# EAGLE design LongWaveModule (EAGLE 9.6.2)
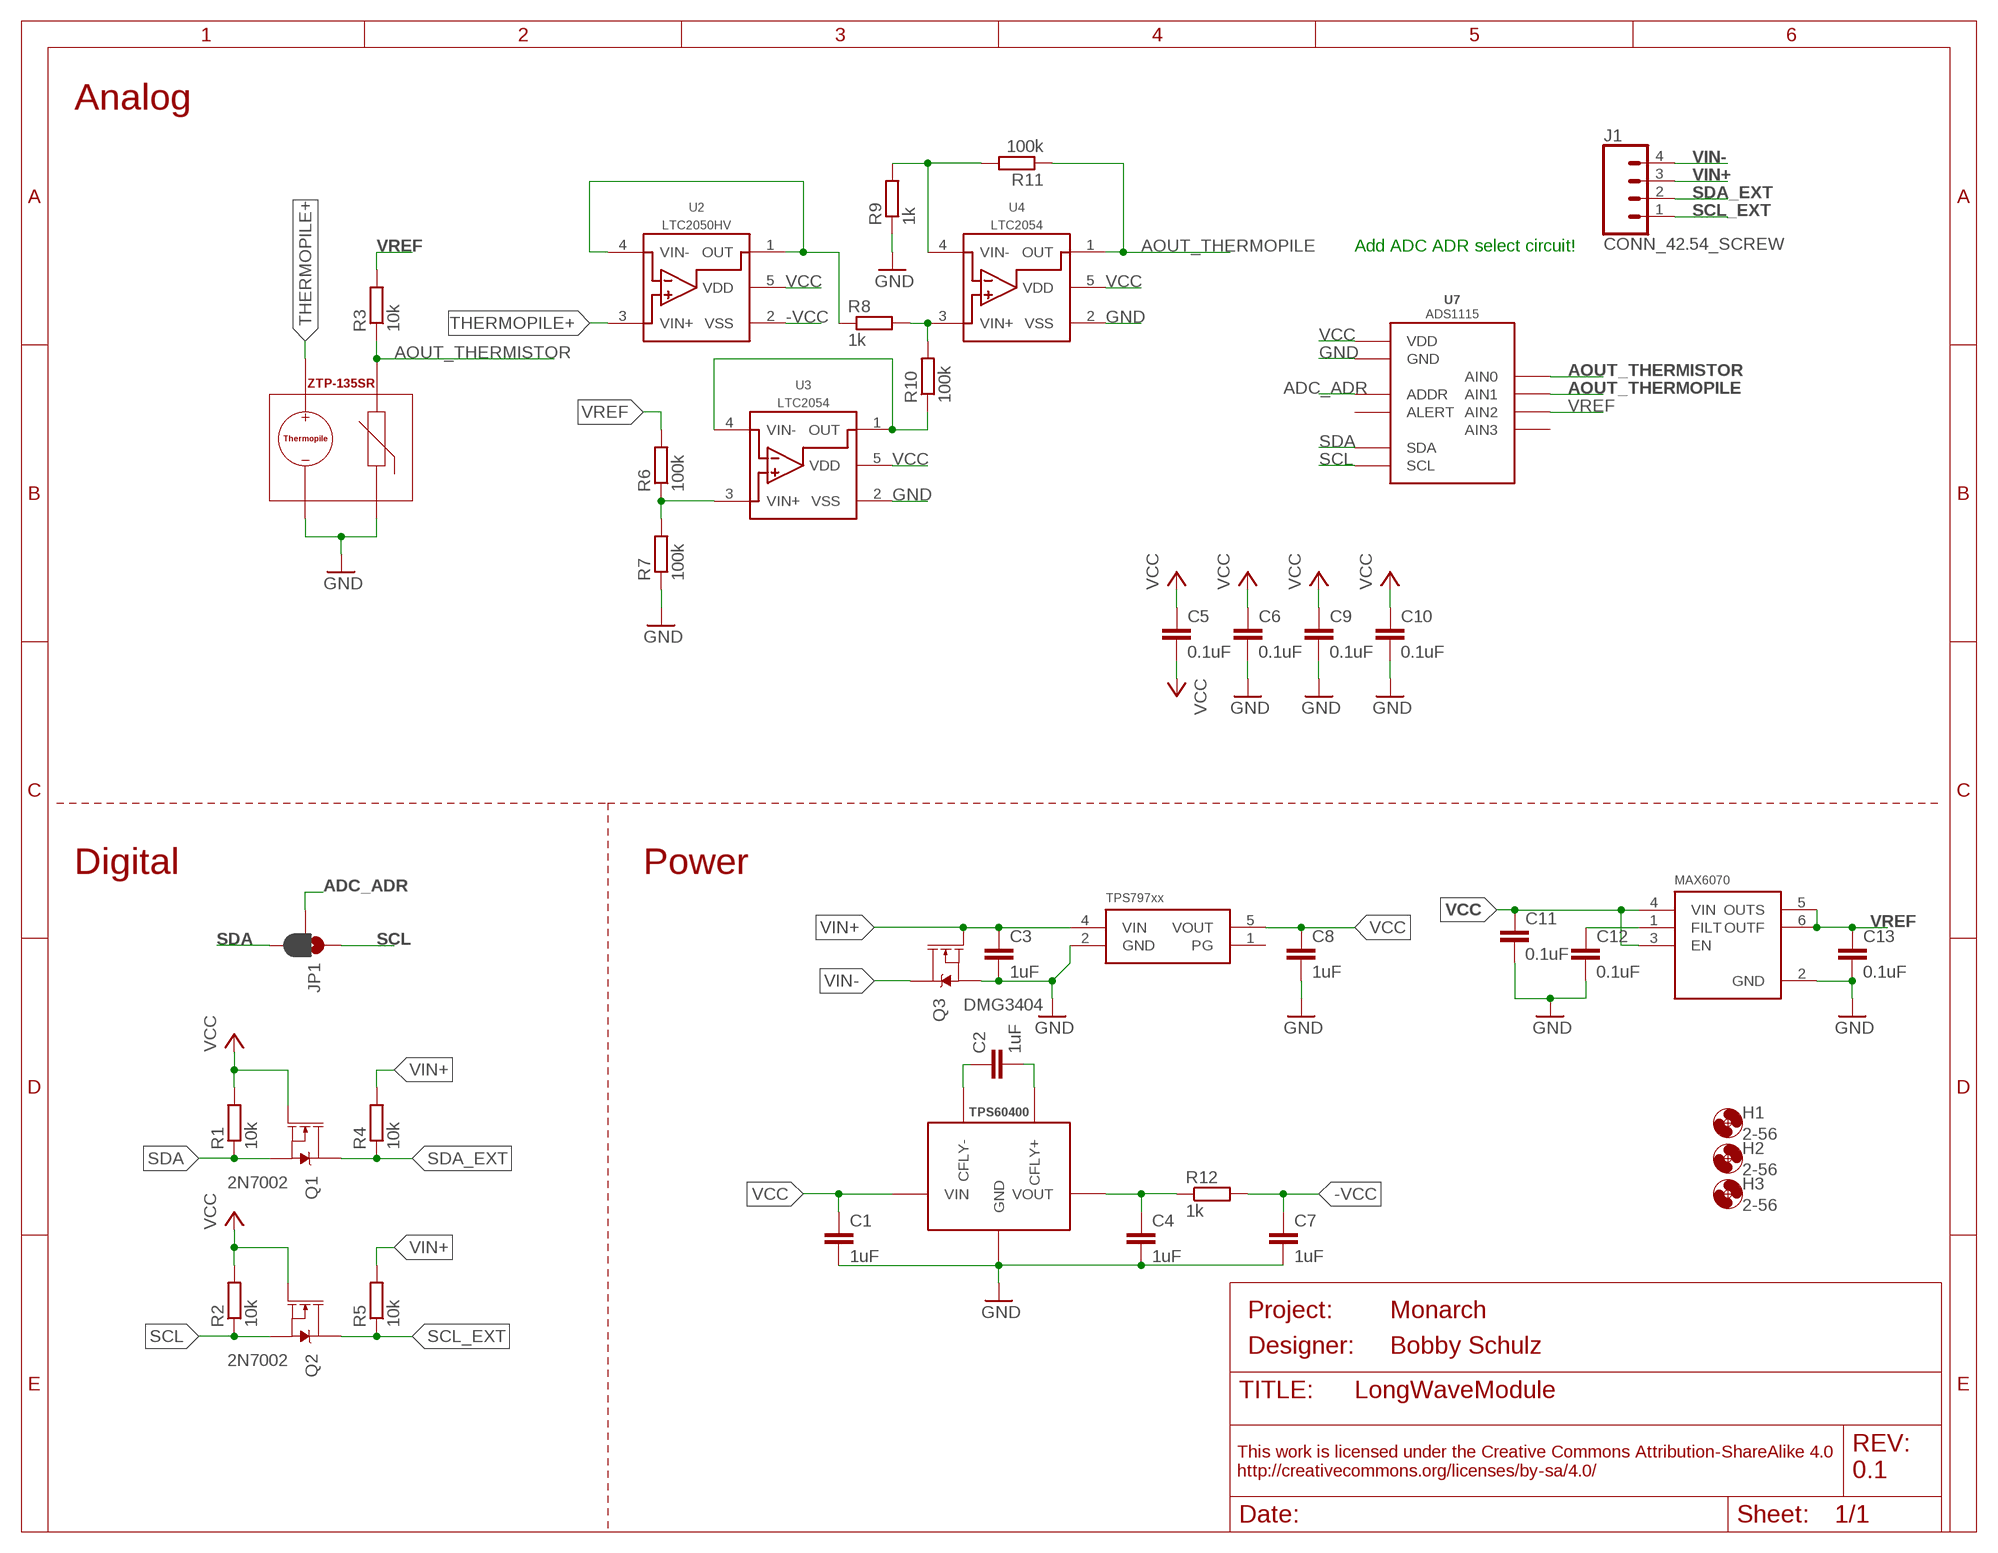
[diagram p0: schematic, sheet 1]
FRAME1 (FRAME_A_L): DESIGNER: Bobby Schulz; PROJECT: Monarch; REV: 0.1

## Parts
C1  1uF  C-EU1UFC0603  [C0603]
C2  1uF  C-EU1UFC0603  [C0603]
C3  1uF  C-EU1UFC0603  [C0603]
C4  1uF  C-EU1UFC0603  [C0603]
C5  0.1uF  C-EU0.1UFC0603  [C0603]
C6  0.1uF  C-EU0.1UFC0603  [C0603]
C7  1uF  C-EU1UFC0603  [C0603]
C8  1uF  C-EU1UFC0603  [C0603]
C9  0.1uF  C-EU0.1UFC0603  [C0603]
C10  0.1uF  C-EU0.1UFC0603  [C0603]
C11  0.1uF  C-EU0.1UFC0603  [C0603]
C12  0.1uF  C-EU0.1UFC0603  [C0603]
C13  0.1uF  C-EU0.1UFC0603  [C0603]
H1  2-56  MOUNTING_HOLE2_NP  [2_56]
H2  2-56  MOUNTING_HOLE2_NP  [2_56]
H3  2-56  MOUNTING_HOLE2_NP  [2_56]
J1  CONN_42.54_SCREW  [1X04_SCREW]
JP1  JUMPER-SMT_3_1-NC_PASTE_SILK  [SMT-JUMPER_3_1-NC_PASTE_SILK]
Q1  2N7002  MOSFET-NCH-2N7002PW  [SOT323]
Q2  2N7002  MOSFET-NCH-2N7002PW  [SOT323]
Q3  DMG3404  MOSFET-NCH-DMG3404L  [SOT23-3]
R1  10k  R-EU_10KR0603  [R0603]
R2  10k  R-EU_10KR0603  [R0603]
R3  10k  R-EU_P10KR0603  [R0603]
R4  10k  R-EU_10KR0603  [R0603]
R5  10k  R-EU_10KR0603  [R0603]
R6  100k  R-EU_P100KR0603  [R0603]
R7  100k  R-EU_P100KR0603  [R0603]
R8  1k  R-EU_P1KR0603  [R0603]
R9  1k  R-EU_P1KR0603  [R0603]
R10  100k  R-EU_P100KR0603  [R0603]
R11  100k  R-EU_P100KR0603  [R0603]
R12  1k  R-EU_1KR0603  [R0603]
U1  STP-135SR  [TO-46]
U2  LTC2050HV  [SOT23-5]
U3  LTC2054  [SOT23-5]
U4  LTC2054  [SOT23-5]
U5  TPS60403  [SOT23-5]
U6  TPS79733  [DCK_R-PDSO-G5]
U7  ADS1115  [VSSOP_10]
U8  MAX6070AAUT18  [SOT23-6L]

## Nets
-VCC: C5.2 C7.1 R12.2 U2.2(VSS) ; supply symbol labelled VCC
ADC_ADR: JP1.2 U7.1(ADDR)
AOUT_THERMISTOR: R3.1 U1.THERMISTOR+ U7.4(AIN0)
AOUT_THERMOPILE: R11.1 U4.1(OUT) U7.5(AIN1)
GND: C1.2 C3.2 C4.2 C6.2 C7.2 C8.2 C9.2 C10.2 C11.2 C12.2 C13.2 Q3.2(S) R7.1 R9.1 U1.THERMISTOR_GND(THERMISTOR-) U1.THERMOPILE_GND(THEMROPILE-) U3.2(VSS) U4.2(VSS) U5.4(GND) U6.2(GND) U7.3(GND) U8.2(GND)
N$1: R8.1 U2.1(OUT) U2.4(VIN-)
N$2: R8.2 R10.2 U4.3(VIN+)
N$3: R9.2 R11.2 U4.4(VIN-)
N$5: R10.1 U3.1(OUT) U3.4(VIN-)
N$6: R6.1 R7.2 U3.3(VIN+)
N$8: C12.1 U8.1(FILT)
N$11: C2.1 U5.3(CFLY-)
N$12: C2.2 U5.5(CFLY+)
N$21: C4.1 R12.1 U5.1(VOUT)
SCL: JP1.1 Q2.2(S) R2.1 U7.10(SCL)
SCL_EXT: J1.1 Q2.3(D) R5.1
SDA: JP1.3 Q1.2(S) R1.1 U7.9(SDA)
SDA_EXT: J1.2 Q1.3(D) R4.1
THERMOPILE+: U1.THERMOPILE+ U2.3(VIN+)
VCC: C1.1 C5.1 C6.1 C8.1 C9.1 C10.1 C11.1 Q1.1(G) Q2.1(G) R1.2 R2.2 U2.5(VDD) U3.5(VDD) U4.5(VDD) U5.2(VIN) U6.5(VOUT) U7.8(VDD) U8.3(EN) U8.4(VIN)
VIN+: C3.1 J1.3 Q3.1(G) R4.2 R5.2 U6.4(VIN)
VIN-: J1.4 Q3.3(D)
VREF: C13.1 R3.2 R6.2 U7.6(AIN2) U8.5(OUTS) U8.6(OUTF)
Unconnected: U6.1(PG) U7.2(ALERT) U7.7(AIN3)

## Notes on the sheet
- Analog
- Add ADC ADR select circuit!
- Digital | Power

## Library data of the parts
C1-C4 C7 C8 = bschulz_passives:C-EU: CAPACITOR, European symbol; DIGIKEY: 1276-6524-1-ND; MF: Samsung; MPN: 1276-6524-1-ND
C5 C6 C9-C13 = bschulz_passives:C-EU: CAPACITOR, European symbol; DIGIKEY: 490-6051-1-ND; MF: Murata; MPN: GCM188R71E104KA57D
H1-H3 = bschulz:MOUNTING_HOLE: Genaric Mechanical Mounting Hole Hole diameter based on max body diameter + 15% Keepout ring is for diameter of socket cap screw (minimum required clearance) TPlace ring is for diameter of pan head screw (recomended clearance) Specifications: Socket Cap <http://fastener-express.com/fastener-technical/SocketscapSS-Alloy.pdf> Button Head Socket Cap <http://fastener-express.com/fastener-technical/Button-Socket-alloy.pdf> Pan Head <http://fastener-express.com/fastener-technical/pan-machine-Screws.pdf>
J1 = bschulz:CONN_4: Genaric 4 pin connector; DIGIKEY: ED10563-ND; MF: On Shore; MPN: OSTVN04A150
JP1 = SparkFun-Jumpers:JUMPER-SMT_3_1-NC_PASTE: Normally closed solder jumper (1 of 2 connections) This jumper has an aperture in the stencil to allow solder paste to bridge one of the two connections. One connection is normally closed (NC), while the other is normally open (NO). Wick off the solder to open the connection. Reapply solder to reclose the connection. Apply solder to the other side instead to change the current path.
Q1 Q2 = bschulz:MOSFET-NCH: N-channel MOSFETs Voltage controlled devices that allow control of high current outputs. SparkFun Products: SparkFun OpenScale <https://www.sparkfun.com/products/13261> SparkFun Digital Sandbox <https://www.sparkfun.com/products/12651> SparkFun Monster Moto Shield <https://www.sparkfun.com/products/10182> SparkFun MOSFET Power Controller <https://www.sparkfun.com/products/11214>; DIGIKEY: 2N7002W-FDICT-ND; MF: Diodes Incorporated; MPN: 2N7002W-7-F; PROD_ID: TRANS-11151
Q3 = bschulz:MOSFET-NCH: N-channel MOSFETs Voltage controlled devices that allow control of high current outputs. SparkFun Products: SparkFun OpenScale <https://www.sparkfun.com/products/13261> SparkFun Digital Sandbox <https://www.sparkfun.com/products/12651> SparkFun Monster Moto Shield <https://www.sparkfun.com/products/10182> SparkFun MOSFET Power Controller <https://www.sparkfun.com/products/11214>; DIGIKEY: DMG3404L-7DICT-ND; MF: Diodes Incorporated; MPN: DMG3404L-7
R1 R2 R4 R5 = bschulz_passives:R-EU_: RESISTOR, European symbol; DIGIKEY: P10.0KHCT-ND; MF: Panasonic; MPN: ERJ-3EKF1002V; VALUE_PART: 10k
R3 = bschulz_passives:R-EU_: RESISTOR, European symbol; DIGIKEY: P10KDBCT-ND; MF: Panasonic; MPN: ERA-3AEB103V; VALUE_PART: 10k
R6 R7 R10 R11 = bschulz_passives:R-EU_: RESISTOR, European symbol; DIGIKEY: P100KDBCT-ND; MF: Panasonic; MPN: ERA-3AEB104V; VALUE_PART: 100k
R8 R9 = bschulz_passives:R-EU_: RESISTOR, European symbol; DIGIKEY: P1.0KDBCT-ND; MF: Panasonic; MPN: ERA-3AEB102V; VALUE_PART: 1k
R12 = bschulz_passives:R-EU_: RESISTOR, European symbol; DIGIKEY: 311-1KLDCT-ND; MF: Yageo; MPN: AC0603FR-071KL; VALUE_PART: 1k
U1 = bschulz:STP-135SR: ZTP-135SR - Thermopile Temp Sensor with integrated thermistor Characteristics: Output Voltage: -6mV ~ +12mV Operating Temperature: -20°C to 120°C Thermistor R0 = 100k Ω Thermistor β = 3960 Digikey: 235-1330-ND <https://www.digikey.com/scripts/DkSearch/dksus.dll?Detail&itemSeq=258317337&uq=636602773549185500>; DIGIKEY: 235-1330-ND; MF: Amphenol; MPN: ZTP-135SR
U2 = bschulz:LTC2050: LTC2050 -Single Micropower Zero Drift Op-Amp Characteristics: Vs: 2.7 ~ 6V (1.35 ~ +/- 5.5V for LTC2054HV) Iq: 1mA GBP: 3MHz PSSR: 130dB CMMR: 130dB Operating Temperature: -40°C to 85°C Digikey: LTC2050IS6#TRMPBFCT-ND <https://www.digikey.com/product-detail/en/linear-technology-analog-devices/LTC2050IS6-TRMPBF/LTC2050IS6-TRMPBFCT-ND/4729352> LTC2050HVIS5#TRPBFCT-ND (High Voltage Variant) <https://www.digikey.com/product-detail/en/linear-technology-analog-devices/LTC2050HVIS5-TRPBF/LTC2050HVIS5-TRPBFCT-ND/8603412>; DIGIKEY: LTC2050HVIS5#TRPBFCT-ND; DISP: LTC2050HV; MF: LT; MPN: LTC2050HVIS5#TRPBF
U3 U4 = bschulz:LTC2054: LTC2054 -Single Micropower Zero Drift Op-Amp Characteristics: Vs: 2.7 ~ 6V (2.7 ~ +/- 5.5V for LTC2054HV) Iq: 175uA GBP: 500kHz PSSR: 130dB CMMR: 130dB Operating Temperature: -40°C to 85°C Digikey: LTC2054CS5#TRPBFCT-ND <https://www.digikey.com/scripts/DkSearch/dksus.dll?Detail&itemSeq=258611552&uq=636603257096973101> LTC2054HVIS5#TRMPBFCT-ND (High Voltage Variant) <https://www.digikey.com/product-detail/en/linear-technology-analog-devices/LTC2054HVIS5-TRMPBF/LTC2054HVIS5-TRMPBFCT-ND/3830416>; DIGIKEY: LTC2054HS5#TRMPBFCT-ND; DISP: LTC2054; MF: LT; MPN: LTC2054HS5#TRMPBF
U5 = bschulz:TPS6040*: TPS6040x - Unregulated Charge Pump Voltage Inverter Characteristics: Vin: 1.8V ~ 5.25V Vout: -Vin Output Current: 60 mA Quiescent Current: 65 ~ 425 uA (depend on model) Operating Temperature: -40°C to125°C Digikey: 296-12013-1-ND, TPS60400 (fsw = 50 ~ 250kHz) <https://www.digikey.com/product-detail/en/texas-instruments/TPS60400DBVT/296-12013-1-ND/429166> 296-37679-1-ND, TPS60401 (fsw = 20kHz) <https://www.digikey.com/product-detail/en/texas-instruments/TPS60401DBVR/296-37679-1-ND/4833911> 296-31988-1-ND, TPS60402 (fsw = 50kHz) <https://www.digikey.com/product-detail/en/texas-instruments/TPS60402DBVR/296-31988-1-ND/3505322> 296-27005-1-ND, TPS60403 (fsw = 250kHz) <https://www.digikey.com/product-detail/en/texas-instruments/TPS60403DBVR/296-27005-1-ND/2255295>; DIGIKEY: 296-27005-1-ND; MF: TI; MPN: TPS60403DBVR
U6 = bschulz:TPS797*: TPS797xx, Ultra low power linear voltage regulator, fixed voltages of 1.8v, 3v, 3.3v Input voltage rage of 1.8-5.5v; DIGIKEY: 296-11990-1-ND; MF: TI; MPN: TPS79733DCKR
U7 = bschulz:ADS111*: ADS1115 - Sigma Delta ADC Characteristics: VCC: 2~5.5V Resolution: 16 bits (12 bits for ADS1015) Number of Inputs: 4 (2 Differenital) Sample Rate: 860 Samples Per Second (3300 for ADS1015) Operating Temperature: -40°C to 125°C Digikey: 296-38849-1-ND (ADS1115) <https://www.digikey.com/scripts/DkSearch/dksus.dll?Detail&itemSeq=258904888&uq=636603311183646020> 296-41185-1-ND (ADS1015) <https://www.digikey.com/product-detail/en/texas-instruments/ADS1015IDGSR/296-41185-1-ND/5222640>; DIGIKEY: 296-38849-1-ND; MF: TI; MPN: ADS1115IDGSR
U8 = bschulz:MAX6070AAUT*: MAX6070 Low Noise high precision voltage referance; DIGIKEY: MAX6070BAUT18+TCT-ND; MF: Maxim; MPN: MAX6070BAUT18+T

## Board
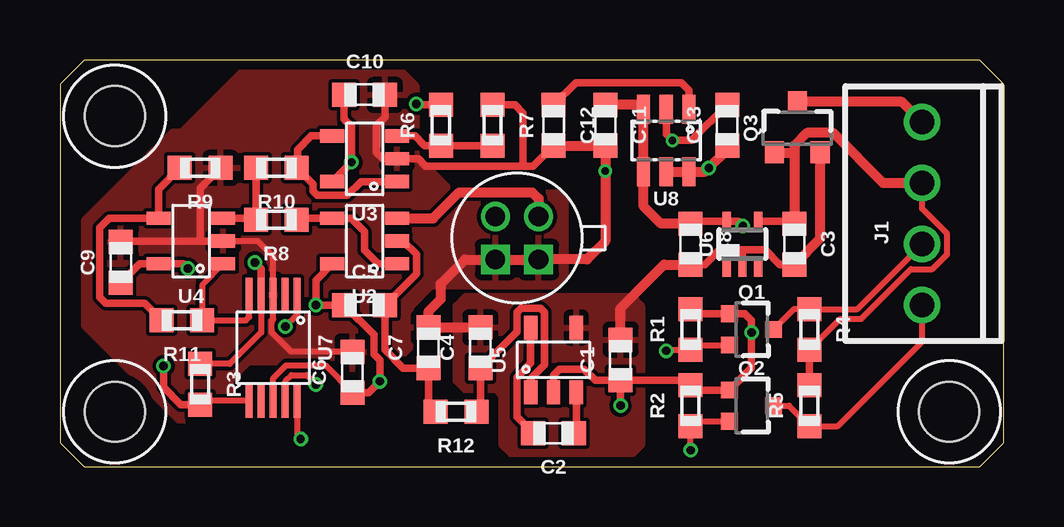
[diagram p1: board, top side]
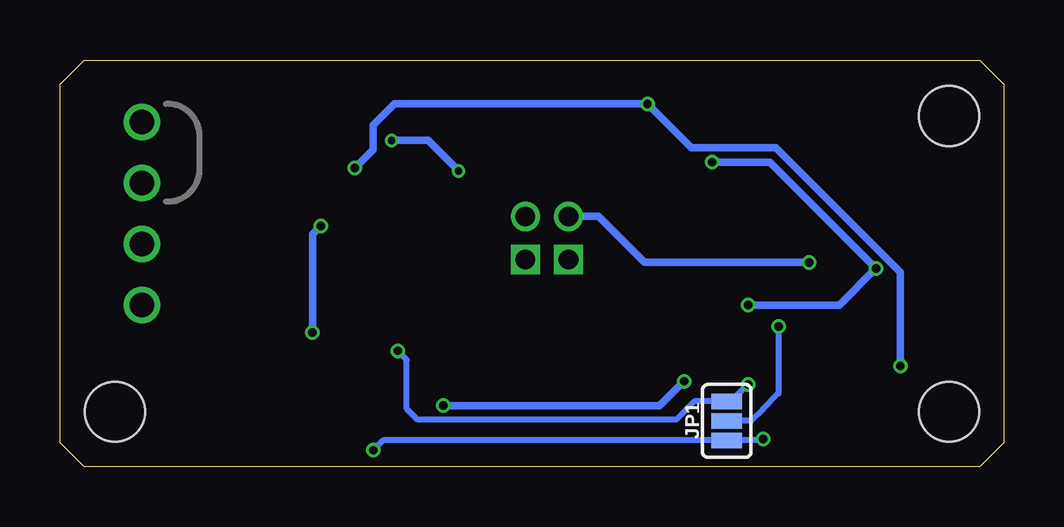
[diagram p2: board, bottom side, seen from below]

Size 39.35 x 16.94 mm. Coordinates in mm from the lower left corner, seen from the top.
Outline: 1,0 38.35,0 39.35,1 39.35,15.94 38.35,16.94 1,16.94 0,15.94 0,1 1,0
Copper layers (1*16): Top 0.035559375mm / dielectric 1.6mm / Bottom 0.035559375mm
Design rules "oshpark-2layer": minimum track width 6mil, minimum drill 10mil, track to track 6mil, track to pad 6mil, pad to pad 6mil, via to via 6mil, smd to smd 6mil, copper to edge 15mil, drill to drill 6mil, minimum pad ring 5mil, minimum via ring 5mil, stop-mask expansion 2.5mil, vias tented up to drill 0mil, thermal gap 10mil

### Footprints (pad centres in the part's own frame; a part is rotated, then mirrored left to right if it is on the bottom)
C0603 = smd 1 x 1: 1 -0.85,0; 2 0.85,0
2_56 = hole 2.5: 0,0
1X04_SCREW = drill 1.016: 1 -3.81,0; 2 -1.27,0; 3 1.27,0; 4 3.81,0
SMT-JUMPER_3_1-NC_PASTE_SILK = smd 0.635 x 1.27: 1 -0.813,0; 2 0,0; 3 0.813,0
SOT323 = smd 0.7 x 0.7: 1 -0.65,-0.925; 2 0.65,-0.925; 3 0,0.925
SOT23-3 = smd 0.8 x 0.9: 1 -0.95,-1; 2 0.95,-1; 3 0,1.1
R0603 = smd 1 x 1: 1 -0.85,0; 2 0.85,0
TO-46 = drill 0.813: THERMISTOR+ -0.898,0.898; THERMOPILE+ 0.898,0.898 | drill 0.813 square: THERMISTOR_GND 0.898,-0.898; THERMOPILE_GND -0.898,-0.898
SOT23-5 = smd 0.55 x 1: 1 -0.95,-1.35; 2 0,-1.35; 3 0.95,-1.35; 4 0.95,1.35; 5 -0.95,1.35
DCK_R-PDSO-G5 = smd 0.35 x 0.8: 1 -0.65,-0.95; 2 0,-0.95; 3 0.65,-0.95; 4 0.65,0.95; 5 -0.65,0.95
VSSOP_10 = smd 0.3 x 1.45: 1 -1,-2.2; 2 -0.5,-2.2; 3 0,-2.2; 4 0.5,-2.2; 5 1,-2.2; 6 1,2.2; 7 0.5,2.2; 8 0,2.2; 9 -0.5,2.2; 10 -1,2.2
SOT23-6L = smd 0.55 x 1.2: 1 -0.95,-1.3; 2 0,-1.3; 3 0.95,-1.3; 4 0.95,1.3; 5 0,1.3; 6 -0.95,1.3

### Placement (x,y rotation side)
C1  23.37,4.45 90 top
C2  20.57,1.4 180 top
C3  30.61,9.27 270 top
C4  17.53,4.95 90 top
C5  12.7,6.73 0 top
C6  12.19,3.94 90 top
C7  15.37,4.95 90 top
C8  26.29,9.27 270 top
C9  2.54,8.51 90 top
C10  12.7,15.49 0 top
C11  22.73,14.22 270 top
C12  20.57,14.22 270 top
C13  27.81,14.22 90 top
H1  2.29,14.61 0 top
H2  2.29,2.29 0 top
H3  37.06,2.29 0 top
J1  35.94,10.54 90 top
JP1  11.56,1.91 90 bottom
Q1  28.83,5.71 270 top
Q2  28.83,2.54 270 top
Q3  30.73,14.1 0 top
R1  26.29,5.71 90 top
R2  26.29,2.54 90 top
R3  5.84,3.43 270 top
R4  31.24,5.71 270 top
R5  31.24,2.54 90 top
R6  15.88,14.22 90 top
R7  18.03,14.22 270 top
R8  9.02,10.29 180 top
R9  5.84,12.45 180 top
R10  9.02,12.45 180 top
R11  5.08,6.1 180 top
R12  16.51,2.29 180 top
U1  19.05,9.53 0 top
U2  12.7,9.4 90 top
U3  12.7,12.83 90 top
U4  5.46,9.4 90 top
U5  20.57,4.45 0 top
U6  28.45,9.27 0 top
U7  8.89,4.95 180 top
U8  25.27,13.59 180 top

### Tracks (layer width: path | path; a pad name or v marks a point on that pad's centre or on a via)
-VCC
  Top 0.305: R12.2 15.37,2.58 C7.1 14.31,4.1 13.55,4.87 C5.2 14.86,8.04 14.86,8.85 14.31,9.4 U2.2
ADC_ADR  (via drill 0.35)
  Top 0.254: U7.1 9.89,6.33 v9.4,5.84
  Bottom 0.254: v9.4,5.84 9.4,3.05 10.03,2.41 10.54,1.91 JP1.2
AOUT_THERMISTOR  (via drill 0.35)
  Top 0.254: U7.4 8.39,5.6 7.07,4.28 R3.1
  Top 0.305: U7.4 8.39,8.25 v8.13,8.51
  Bottom 0.305: U1.THERMISTOR+ 16.9,10.42 14.99,8.51 v8.13,8.51
AOUT_THERMOPILE
  Top 0.254: U4.1 5.93,7.57 R11.1 7.75,6.1 7.89,6.24 U7.5
GND  (via drill 0.3)
  Top 0.254: U4.2 8.26,9.4 8.89,8.76 U7.3 8.89,6.16 8.82,6.08 8.82,5.6 9.63,4.79 C6.2 | C10.2 13.29,15.49
  Top 0.305: C8.2 26.89,8.42 27.5,9.03 28.45,9.03 | C3.2 30,8.42 29.4,9.03 28.45,9.03 | U6.2 28.45,9.03 | C10.2 13.55,14.57 13.21,14.22 13.21,13.08 13.46,12.83 U3.2 14.94,12.83 15.25,12.52 19.3,12.52 | 19.3,12.52 19.72,12.52 C12.2 | R7.1 18.96,15.07 19.3,14.73 19.3,12.52 | R9.1 5.84,11.6 5.84,9.4 | U4.2 5.84,9.4 | 5.84,9.4 2.58,9.4 C9.2 | C13.2 26.33,13.59 v25.53,13.59 25.27,13.84 U8.2
  Top 0.406: C12.2 C11.2 v22.73,12.32 22.73,9.4 21.97,8.64 U1.THERMISTOR_GND U1.THERMOPILE_GND 16.88,8.63 15.88,7.62 15.88,6.99 15.37,6.48 C7.2 C4.2 | Q3.2 31.68,9.5 C3.2 | C1.2 23.37,6.6 25.18,8.42 C8.2 | 25.27,14.73 U8.2
  Bottom 0.305: v25.53,13.59 24,13.59 v22.73,12.32
  pour Top: 16.51,6.73 16.89,7.11 23.88,7.11 24.26,6.73 24.26,0.89 23.88,0.51 18.8,0.51 18.41,0.89 18.41,2.92 18.16,3.17 16.89,3.17 16.51,3.56
  pour Top: 5.08,13.97 7.87,16.76 13.97,16.76 14.86,15.88 14.86,12.95 16.38,11.43 20.7,11.43 21.08,11.05 21.08,7.87 20.7,7.49 15.49,7.49 14.61,6.6 14.61,4.95 13.72,4.06 11.18,4.06 10.92,4.32 7.87,4.32 7.11,3.56 7.11,2.29 6.73,1.91 4.95,1.91 1.02,5.84 1.02,10.29 4.7,13.97
N$1
  Top 0.305: U2.1 13.27,8.45 12.7,9.02 12.7,9.78 12.13,10.35 U2.4 9.93,10.35 R8.1
N$2
  Top 0.305: U4.3 8.11,10.35 R8.2 R10.2
N$3
  Top 0.305: R9.2 4.11,11.56 U4.4 2.05,10.35 1.65,9.95 1.65,7.07 1.91,6.8 3.52,6.8 R11.2
N$5
  Top 0.305: U3.1 12.56,11.88 11.98,11.3 10.72,11.3 10.54,11.48 10.54,11.77 R10.1 9.91,12.48 9.91,13.21 10.47,13.78 U3.4
N$6
  Top 0.305: U3.3 14.8,13.78 15.2,13.37 R6.1 R7.2
N$8
  Top 0.305: C12.1 21.5,16 25.91,16 26.22,15.69 U8.1
N$11
  Top 0.305: C2.1 21.52,1.5 U5.3
N$12
  Top 0.305: U5.5 19.62,4.3 19.04,3.72 19.04,2.08 C2.2
N$21
  Top 0.305: U5.1 19.62,3.65 20.2,4.23 20.2,6.42 20.02,6.6 19.22,6.6 19.04,6.42 19.04,5.62 C4.1 17.53,2.45 R12.1
SCL  (via drill 0.35)
  Top 0.254: Q2.2 26.49,1.89 R2.1 v26.29,0.68 | U7.10 9.89,1.29 v10.03,1.14
  Bottom 0.254: v10.03,1.14 10.08,1.09 JP1.1 25.88,1.09 v26.29,0.68
SCL_EXT
  Top 0.254: Q2.3 30.39,2.54 R5.1 32.42,1.69 35.94,5.21 J1.1
SDA  (via drill 0.35)
  Top 0.254: Q1.2 26.49,5.07 R1.1 25.31,4.87 v25.27,4.83 | U7.9 9.39,3.55 9.65,3.81 10.29,3.81 v10.67,3.43
  Bottom 0.254: v10.67,3.43 11.38,2.72 JP1.3 12.9,2.72 13.66,1.96 24.44,1.96 24.89,2.41 24.89,4.45 v25.27,4.83
SDA_EXT
  Top 0.254: Q1.3 30.6,6.57 R4.1 33.23,6.57 J1.2
THERMOPILE+
  Top 0.406: U2.3 15.55,10.35 16.64,11.43 19.68,11.43 19.95,11.17 U1.THERMOPILE+
VCC  (via drill 0.35)
  Top 0.254: U7.8 8.89,3.68 9.42,4.22 11.06,4.22 C6.1
  Top 0.305: R1.2 26.49,6.37 Q1.1 28.56,6.37 28.83,6.1 v28.83,5.59 28.83,4.12 Q2.1 26.49,3.19 R2.2 26.08,3.6 C1.1 | C8.1 26.39,10.22 U6.5 28.28,10.22 v28.47,10.03 | U5.2 20.57,3.81 20.83,4.06 21.84,4.06 22.31,3.6 C1.1 | C10.1 11.85,14.48 12.15,14.18 v12.15,12.68 U3.5 | C9.1 3.33,8.45 U4.5 5.14,8.45 v5.33,8.26 | U2.5 10.67,7.77 v10.67,6.73 C5.1 13.09,5.49 13.09,4.68 13.34,4.43 v13.34,3.56 12.87,3.09 C6.1 | v23.37,2.54 C1.1
  Top 0.406: C11.1 24.14,15.07 U8.3 U8.4 24.32,10.86 25.06,10.12 C8.1
  Bottom 0.305: v10.67,6.73 6.86,6.73 v5.33,8.26 9.76,12.68 v12.15,12.68 | v13.34,3.56 14.35,2.54 v23.37,2.54 | v28.83,5.59 28.83,9.67 v28.47,10.03
VIN+
  Top 0.254: R4.2 32.54,6.16 33.4,6.16 35.47,8.23 36.37,8.23 36.98,8.84 36.98,9.7 35.94,10.74 J1.3
  Top 0.305: R5.2 R4.2 | C3.1 30.51,10.22 U6.4
  Top 0.406: J1.3 34.32,11.81 32.23,13.9 31.14,13.9 30.61,13.37 30.61,13.08 | 30.61,13.08 C3.1 | Q3.1 29.8,13.08 30.61,13.08
VIN-
  Top 0.406: J1.4 35.09,15.2 Q3.3
VREF  (via drill 0.35)
  Top 0.254: U7.6 6.02,2.75 R3.2
  Top 0.305: R6.2 14.9,15.07 v14.86,15.11 | v4.32,4.19 4.32,3.3 5.04,2.58 R3.2
  Top 0.406: U8.5 U8.6 26.89,12.29 v27.05,12.45 27.81,13.21 C13.1
  Bottom 0.305: v4.32,4.19 4.32,8.1 9.51,13.29 13.04,13.29 v14.86,15.11 25.4,15.11 26.29,14.22 26.29,13.21 v27.05,12.45

### Text on the board
bDocu: GND | Project Monarch v0.1 / LongWave / ---------------- / Developed by / Northern Widget and / University of Minnesota | ± | Vin | To Logger | 3.3v~5v | SDA | SCL | J0 | 0x4A | ADR / Select | 0x4B